# EAGLE design STM32-RF (EAGLE 6.4)
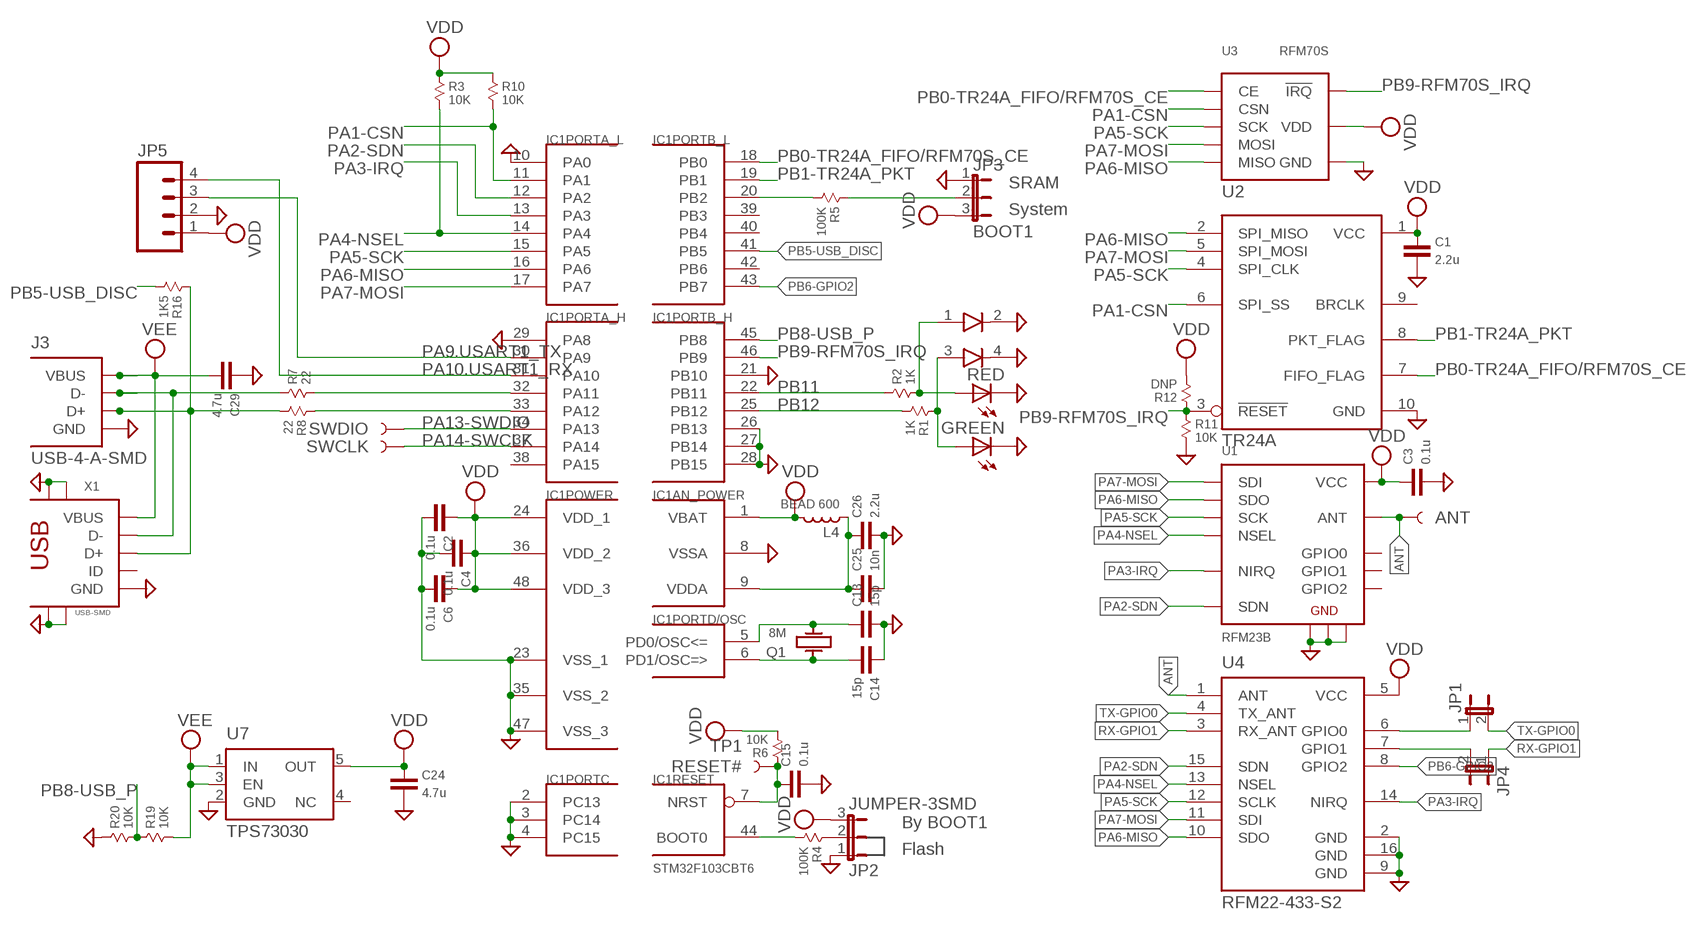
[diagram p0: schematic, sheet 1]

## Parts
ANT  TEST-POINT1  [PAD.1X1]
C1  2.2u  CAP-0603  [0603]
C2  0.1u  CAP-0603  [0603]
C3  0.1u  CAP-0603  [0603]
C4  0.1u  CAP-0603  [0603]
C6  0.1u  CAP-0603  [0603]
C13  15p  CAP-0603  [0603]
C14  15p  CAP-0603  [0603]
C15  0.1u  CAP-0603  [0603]
C24  4.7u  CAP-0603  [0603]
C25  10n  CAP-0603  [0603]
C26  2.2u  CAP-0603  [0603]
C29  4.7u  CAP-0603  [0603]
GREEN  LEDCHIPLED_0603  [CHIPLED_0603]
IC1  STM32F103CBT6  STM32F10XCXT6  [TQFP48]
J3  USB-4-A-SMD  [USB-A-SMD]
JP1  JUMPER-2SMD-NO  [SJ_2S-NO]
JP2  JUMPER-3SMD  [SJ_3]
JP3  BOOT1  JUMPER-3SMD  [SJ_3]
JP4  JUMPER-2SMD-NO  [SJ_2S-NO]
JP5  M04PTH  [1X04]
L4  BEAD 600  INDUCTOR-0603  [0603]
Q1  8M  CRYSTAL-KX-9A  [KX-9A]
R1  1K  RESISTOR-0603  [0603]
R2  1K  RESISTOR-0603  [0603]
R3  10K  RESISTOR-0603  [0603]
R4  100K  RESISTOR-0603  [0603]
R5  100K  RESISTOR-0603  [0603]
R6  10K  RESISTOR-0603  [0603]
R7  22  RESISTOR-0603  [0603]
R8  22  RESISTOR-0603  [0603]
R10  10K  RESISTOR-0603  [0603]
R11  10K  RESISTOR-0603  [0603]
R12  DNP  RESISTOR-0603  [0603]
R16  1K5  RESISTOR-0603  [0603]
R19  10K  RESISTOR-0603  [0603]
R20  10K  RESISTOR-0603  [0603]
RED  LEDCHIPLED_0603  [CHIPLED_0603]
RESET#  TP1  TEST-POINT1  [PAD.1X1]
SWCLK  TEST-POINT1  [PAD.1X1]
SWDIO  TEST-POINT1  [PAD.1X1]
U1  RFM23B  [RFM2X]
U2  TR24A  [TR24A]
U3  RFM70S  [RFM70S]
U4  RFM22-433-S2  [RFM2X]
U7  TPS73030  TPS73033  [SOT23-5]
U$1  LED-DUAL-0605  [LED-DUAL-0605]
X1  USB-SMD  [USB-MINIB]

## Nets
ANT: ANT.P$1 U1.1(ANT) U4.1(ANT)
BOOT0: IC1.44(RESET:BOOT0) R4.2
GND: C1.1 C2.1 C3.1 C4.1 C6.1 C13.1 C14.2 C15.1 C24.1 C25.1 C26.1 C29.2 GREEN.C IC1.2(PORTC:PC13) IC1.3(PORTC:PC14) IC1.4(PORTC:PC15) IC1.8(AN_POWER:VSSA) IC1.10(PORTA_L:PA0) IC1.21(PORTB_H:PB10) IC1.23(POWER:VSS_1) IC1.26(PORTB_H:PB13) IC1.27(PORTB_H:PB14) IC1.28(PORTB_H:PB15) IC1.29(PORTA_H:PA8) IC1.35(POWER:VSS_2) IC1.47(POWER:VSS_3) J3.GND JP2.1 JP3.1 JP5.2 R11.2 R20.1 RED.C U1.2(GND) U1.9(GND) U1.16(GND) U2.10(GND) U3.GND U4.2(GND) U4.9(GND) U4.16(GND) U7.2(GND) U$1.2 U$1.4 X1.GND X1.GND@1(GND) X1.GND@2(GND) X1.GND@3(GND) X1.GND@4(GND)
LED-RED: R2.2 RED.A U$1.1
N$3: C25.2 C26.2 IC1.9(AN_POWER:VDDA) L4.1
N$4: JP1.1 U4.6(GPIO0)
N$5: GREEN.A R1.1 U$1.3
N$6: JP4.2 U4.7(GPIO1)
N$7: JP2.2 R4.1
N$8: JP3.2 R5.1
N$10: J3.D- R7.1 X1.D-
N$13: J3.D+ R8.2 R16.1 X1.D+
OSCIN: C14.1 IC1.6(PORTD/OSC:PD1/OSC=>) Q1.1
OSCOUT: C13.2 IC1.5(PORTD/OSC:PD0/OSC<=) Q1.3
PA1-CSN: IC1.11(PORTA_L:PA1) R10.2 U2.6(SPI_SS) U3.CSN
PA2-SDN: IC1.12(PORTA_L:PA2) U1.15(SDN) U4.15(SDN)
PA3-IRQ: IC1.13(PORTA_L:PA3) U1.14(NIRQ) U4.14(NIRQ)
PA4-NSEL: IC1.14(PORTA_L:PA4) R3.2 U1.13(NSEL) U4.13(NSEL)
PA5-SCK: IC1.15(PORTA_L:PA5) U1.12(SCK) U2.4(SPI_CLK) U3.SCK U4.12(SCLK)
PA6-MISO: IC1.16(PORTA_L:PA6) U1.10(SDO) U2.2(SPI_MISO) U3.MISO U4.10(SDO)
PA7-MOSI: IC1.17(PORTA_L:PA7) U1.11(SDI) U2.5(SPI_MOSI) U3.MOSI U4.11(SDI)
PA9.USART1_TX: IC1.30(PORTA_H:PA9) JP5.3
PA10.USART1_RX: IC1.31(PORTA_H:PA10) JP5.4
PA11: IC1.32(PORTA_H:PA11) R7.2
PA12: IC1.33(PORTA_H:PA12) R8.1
PA13-SWDIO: IC1.34(PORTA_H:PA13) SWDIO.P$1
PA14-SWCLK: IC1.37(PORTA_H:PA14) SWCLK.P$1
PB0-TR24A_FIFO/RFM70S_CE: IC1.18(PORTB_L:PB0) U2.7(FIFO_FLAG) U3.CE
PB1-TR24A_PKT: IC1.19(PORTB_L:PB1) U2.8(PKT_FLAG)
PB2/BOOT1: IC1.20(PORTB_L:PB2) R5.2
PB5-USB_DISC: IC1.41(PORTB_L:PB5) R16.2
PB6-GPIO2: IC1.43(PORTB_L:PB7) U4.8(GPIO2)
PB8-USB_P: IC1.45(PORTB_H:PB8) R19.1 R20.2
PB9-RFM70S_IRQ: IC1.46(PORTB_H:PB9) R11.1 R12.1 U2.3(!RESET) U3.IRQ(!IRQ)
PB11: IC1.22(PORTB_H:PB11) R2.1
PB12: IC1.25(PORTB_H:PB12) R1.2
RESET#: C15.2 IC1.7(RESET:NRST) R6.1 RESET#.P$1
RX-GPIO1: JP4.1 U4.3(RX_ANT)
TX-GPIO0: JP1.2 U4.4(TX_ANT)
VDD: C1.2 C2.2 C3.2 C4.2 C6.2 C24.2 IC1.1(AN_POWER:VBAT) IC1.24(POWER:VDD_1) IC1.36(POWER:VDD_2) IC1.48(POWER:VDD_3) JP2.3 JP3.3 JP5.1 L4.2 R3.1 R6.2 R10.1 R12.2 U1.5(VCC) U2.1(VCC) U3.VDD U4.5(VCC) U7.5(OUT)
VEE: C29.1 J3.VUSB(VBUS) R19.2 U7.1(IN) U7.3(EN) X1.VBUS
Unconnected: IC1.38(PORTA_H:PA15) IC1.39(PORTB_L:PB3) IC1.40(PORTB_L:PB4) IC1.42(PORTB_L:PB6) U1.3(NC) U1.4(NC) U1.6(GPIO0) U1.7(GPIO1) U1.8(GPIO2) U2.9(BRCLK) U7.4(NC) X1.ID

## Notes on the sheet
- SRAM
- System
- By BOOT1
- Flash

## Library data of the parts
ANT RESET# SWCLK SWDIO = SparkFun:TEST-POINT
C1-C4 C6 C13-C15 C24-C26 C29 = X893:CAP: Capacitor
GREEN RED = led:LED: LED OSRAM: - CHIPLED LG R971, LG N971, LY N971, LG Q971, LY Q971, LO R971, LY R971 LH N974, LH R974 LS Q976, LO Q976, LY Q976 LO Q996 - Hyper CHIPLED LW Q18S LB Q993, LB Q99A, LB R99A - SideLED LS A670, LO A670, LY A670, LG A670, LP A670 LB A673, LV A673, LT A673, LW A673 LH A674 LY A675 LS A676, LA A676, LO A676, LY A676, LW A676 LS A679, LY A679, LG A679 - Hyper Micro SIDELED® LS Y876, LA Y876, LO Y876, LY Y876 LT Y87S - SmartLED LW L88C, LW L88S LB L89C, LB L89S, LG L890 LS L89K, LO L89K, LY L89K LS L896, LA L896, LO L896, LY L896 - TOPLED LS T670, LO T670, LY T670, LG T670, LP T670 LSG T670, LSP T670, LSY T670, LOP T670, LYG T670 LG T671, LOG T671, LSG T671 LB T673, LV T673, LT T673, LW T673 LH T674 LS T676, LA T676, LO T676, LY T676, LB T676, LH T676, LSB T676, LW T676 LB T67C, LV T67C, LT T67C, LS T67K, LO T67K, LY T67K, LW E67C LS E67B, LA E67B, LO E67B, LY E67B, LB E67C, LV E67C, LT E67C LW T67C LS T679, LY T679, LG T679 LS T770, LO T770, LY T770, LG T770, LP T770 LB T773, LV T773, LT T773, LW T773 LH T774 LS E675, LA E675, LY E675, LS T675 LS T776, LA T776, LO T776, LY T776, LB T776 LHGB T686 LT T68C, LB T68C - Hyper Mini TOPLED® LB M676 - Mini TOPLED Santana® LG M470 LS M47K, LO M47K, LY M47K Source: http://www.osram.convergy.de LUXEON: - LUMILED® LXK2-PW12-R00, LXK2-PW12-S00, LXK2-PW14-U00, LXK2-PW14-V00 LXK2-PM12-R00, LXK2-PM12-S00, LXK2-PM14-U00 LXK2-PE12-Q00, LXK2-PE12-R00, LXK2-PE12-S00, LXK2-PE14-T00, LXK2-PE14-U00 LXK2-PB12-K00, LXK2-PB12-L00, LXK2-PB12-M00, LXK2-PB14-N00, LXK2-PB14-P00, LXK2-PB14-Q00 LXK2-PR12-L00, LXK2-PR12-M00, LXK2-PR14-Q00, LXK2-PR14-R00 LXK2-PD12-Q00, LXK2-PD12-R00, LXK2-PD12-S00 LXK2-PH12-R00, LXK2-PH12-S00 LXK2-PL12-P00, LXK2-PL12-Q00, LXK2-PL12-R00 Source: www.luxeon.com KINGBRIGHT: KA-3528ASYC Source: www.kingbright.com
IC1 = stm32:STM32F10XCXT6: ST STM32F101/103 48pin LQFP
J3 = X893:USB-4: http://www.hirose.co.jp/cataloge_hp/e24200011.pdf
JP1 JP4 = SparkFun:JUMPER-2: Jumper Basic 0.1" spaced jumper. Use with breakaway headers.
JP2 JP3 = SparkFun:JUMPER-3
JP5 = SparkFun:M04: Header 4 Standard 4-pin 0.1" header. Use with straight break away headers (SKU : PRT-00116), right angle break away headers (PRT-00553), swiss pins (PRT-00743), machine pins (PRT-00117), and female headers (PRT-00115). Molex polarized connector foot print use with SKU : PRT-08231 with associated crimp pins and housings.
L4 = X893:INDUCTOR: http://www.murata.com/products/catalog/pdf/o05e.pdf
Q1 = X893:CRYSTAL: Crystal
R1-R8 R10-R12 R16 R19 R20 = X893:RESISTOR
U1 = X893:RFM23B
U2 = X893:TR24A
U3 = X893:RFM70S: http://www.terraelectronica.ru/pdf/HOPERF/RFM70.pdf
U4 = X893:RFM22: http://www.terraelectronica.ru/pdf/HOPERF/RFM22.pdf
U7 = X893:TPS73033: LOW-NOISE, HIGH PSRR, RF 200-mA LOW-DROPOUT LINEAR REGULATOR http://www.terraelectronica.ru/pdf/TI/TPS73033.pdf
U$1 = X893:LED-DUAL
X1 = X893:USB: USB Connectors USB-B-PTH is fully proven SKU : PRT-00139 USB-miniB is fully proven SKU : PRT-00587 USB-A-PCB is untested. USB-A-H is throughly reviewed, but untested. Spark Fun Electronics SKU : PRT-00437 USB-B-SMT is throughly reviewed, but untested. Needs silkscreen touching up. USB-A-S has not been used/tested USB-MB-H has not been used/tested

## Board
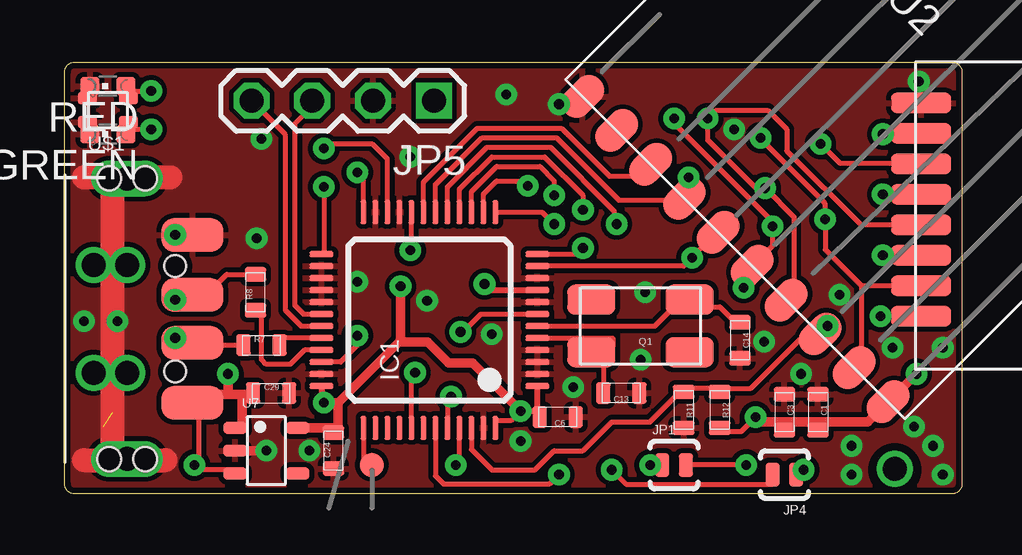
[diagram p1: board, top side]
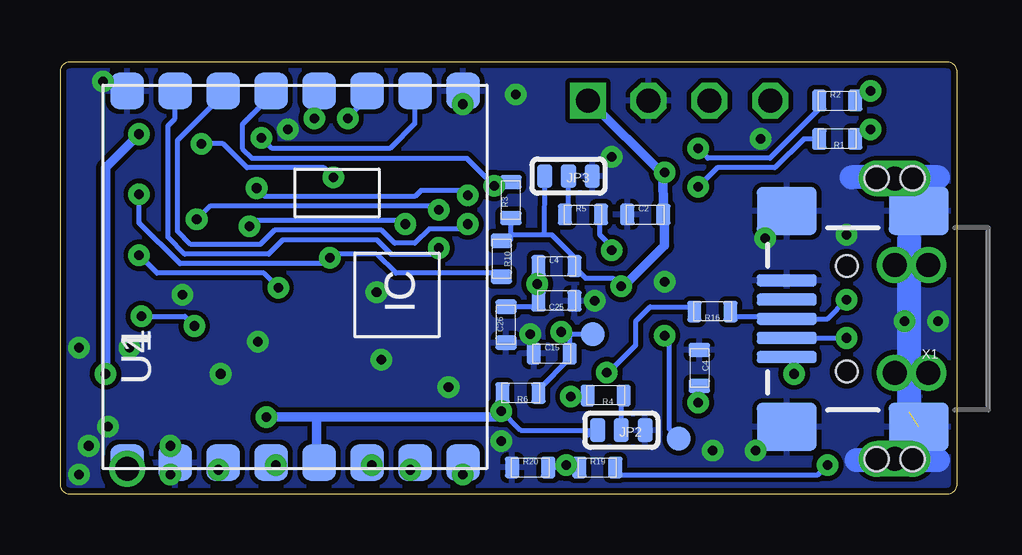
[diagram p2: board, bottom side, seen from below]

Size 37.4 x 18 mm. Coordinates in mm from the lower left corner, seen from the top.
Outline: 0,0.4 0,17.6 arc-90 0.4,18 37,18 arc-90 37.4,17.6 37.4,0.4 arc-90 37,0 0.4,0 arc-90 0,0.4
Copper layers (1+16): Top 0.035mm / dielectric 1.5mm / Bottom 0.035mm
Design rules "Rezonit": minimum track width 0.2mm, minimum drill 0.4mm, track to track 0.2mm, track to pad 0.2mm, pad to pad 0.2mm, via to via 0.2mm, smd to smd 0mil, copper to edge 0.25mm, drill to drill 0.2mm, minimum pad ring 0.25mm, minimum via ring 0.25mm, stop-mask expansion 4mil, vias tented up to drill 0.4mm, thermal gap 0.2mm
tRestrict: area 33.6,0 to 35.6,2
bRestrict: area 33.6,0 to 35.6,2

### Footprints (pad centres in the part's own frame; a part is rotated, then mirrored left to right if it is on the bottom)
PAD.1X1 = smd 1 x 1: P$1 0,0
0603 = smd 0.6 x 0.9: 1 -0.75,0; 2 0.75,0
CHIPLED_0603 = smd 0.8 x 0.8: A 0,-0.75; C 0,0.75
TQFP48 = smd 0.25 x 1: 1 -2.75,-4.5; 2 -2.25,-4.5; 3 -1.75,-4.5; 4 -1.25,-4.5; 5 -0.75,-4.5; 6 -0.25,-4.5; 7 0.25,-4.5; 8 0.75,-4.5; 9 1.25,-4.5; 10 1.75,-4.5; 11 2.25,-4.5; 12 2.75,-4.5; 25 2.75,4.5; 26 2.25,4.5; 27 1.75,4.5; 28 1.25,4.5; 29 0.75,4.5; 30 0.25,4.5; 31 -0.25,4.5; 32 -0.75,4.5; 33 -1.25,4.5; 34 -1.75,4.5; 35 -2.25,4.5; 36 -2.75,4.5 | smd 1 x 0.25: 13 4.5,-2.75; 14 4.5,-2.25; 15 4.5,-1.75; 16 4.5,-1.25; 17 4.5,-0.75; 18 4.5,-0.25; 19 4.5,0.25; 20 4.5,0.75; 21 4.5,1.25; 22 4.5,1.75; 23 4.5,2.25; 24 4.5,2.75; 37 -4.5,2.75; 38 -4.5,2.25; 39 -4.5,1.75; 40 -4.5,1.25; 41 -4.5,0.75; 42 -4.5,0.25; 43 -4.5,-0.25; 44 -4.5,-0.75; 45 -4.5,-1.25; 46 -4.5,-1.75; 47 -4.5,-2.25; 48 -4.5,-2.75
USB-A-SMD = smd 2.6 x 1.4: D+ 5.325,1; D- 5.325,-1; GND 5.325,3.5; VUSB 5.325,-3.5 | drill 1 pad 1.4 long: GND@1 2.6,5.85; GND@2 2.6,-5.85 | drill 1: P$1 2.6,2.25; P$2 2.6,-2.25; P$3 1.2,2.25; P$4 1.2,-2.25 | hole 1: 3.35,-5.85; 1.85,-5.85; 3.35,5.85; 1.85,5.85
SJ_2S-NO = smd 0.6 x 1: 1 -0.49,0; 2 0.49,0
SJ_3 = smd 0.635 x 1: 1 -0.99,0; 2 0,0; 3 0.99,0
1X04 = drill 1 pad 1.5 square: 1 0,0 | drill 1 pad 1.5 octagon: 2 2.54,0; 3 5.08,0; 4 7.62,0
KX-9A = smd 2 x 1.25: 1 -2.05,-1.1; 2 2.05,-1.1; 3 2.05,1.1; 4 -2.05,1.1
RFM2X = smd 1.5 x 1.4: 1 -7.75,7; 2 -7.75,5; 3 -7.75,3; 4 -7.75,1; 5 -7.75,-1; 6 -7.75,-3; 7 -7.75,-5; 8 -7.75,-7; 9 7.75,-7; 10 7.75,-5; 11 7.75,-3; 12 7.75,-1; 13 7.75,1; 14 7.75,3; 15 7.75,5; 16 7.75,7
TR24A = smd 1.27 x 2: 1 9,-10.25; 2 7,-10.25; 3 5,-10.25; 4 3,-10.25; 5 1,-10.25; 6 -1,-10.25; 7 -3,-10.25; 8 -5,-10.25; 9 -7,-10.25; 10 -9,-10.25
RFM70S = smd 0.85 x 2.5: CE -2.16,-1.4; CSN -0.89,-1.4; GND -4.7,-1.4; IRQ 4.19,-1.4; MISO 2.92,-1.4; MOSI 1.65,-1.4; SCK 0.38,-1.4; VDD -3.43,-1.4
SOT23-5 = smd 0.5 x 1: 1 -0.95,-1.3; 2 0,-1.3; 3 0.95,-1.3; 4 0.95,1.3; 5 -0.95,1.3
LED-DUAL-0605 = smd 0.5 x 0.8: 1 -0.5,0.85; 2 -0.5,-0.85; 3 0.5,0.85; 4 0.5,-0.85
USB-MINIB = smd 2.5 x 0.5: D+ 2.5,0; D- 2.5,0.8; GND 2.5,-1.6; ID 2.5,-0.8; VBUS 2.5,1.6 | smd 2.5 x 2: GND@1 -3,-4.5; GND@2 -3,4.5; GND@3 2.5,4.5; GND@4 2.5,-4.5 | hole 0.9: 0,2.2; 0,-2.2

### Placement (x,y rotation side)
ANT  34.6,1.05 0 top
C1  31.4,3.4 270 top
C2  13,11.65 0 bottom
C3  30,3.4 270 top
C4  10.75,5.25 270 bottom
C6  20.55,3.2 180 top
C13  23.2,4.2 180 top
C14  28.15,6.4 270 top
C15  16.9,5.85 0 bottom
C24  11.2,1.8 90 top
C25  16.7,8.05 180 bottom
C26  18.8,7.05 90 bottom
C29  8.6,4.2 0 top
GREEN  1.8,15 90 top
IC1  15.2,7.25 90 top
J3  0,7.3 0 top
JP1  25.4,1.2 0 top
JP2  14,2.65 180 bottom
JP3  16.2,13.25 180 bottom
JP4  30,0.8 180 top
JP5  15.4,16.39 180 top
L4  16.7,9.5 0 bottom
Q1  24,7 180 top
R1  5,14.8 180 bottom
R2  5,16.4 0 bottom
R3  18.6,12.25 90 bottom
R4  14.65,4.1 180 bottom
R5  15.6,11.65 0 bottom
R6  18.2,4.2 180 bottom
R7  8.2,6.2 0 top
R8  7.95,8.4 90 top
R10  19,9.8 270 bottom
R11  25.8,3.5 270 top
R12  27.3,3.5 270 top
R16  10.2,7.6 180 bottom
R19  15,1.1 0 bottom
R20  17.8,1.1 0 bottom
RED  1.8,17 90 top
RESET#  15.2,6.65 270 bottom
SWCLK  12.8,1.2 0 top
SWDIO  11.6,2.3 0 bottom
U1  27.6,9.05 90 bottom
U2  35.2,17.45 315 top
U3  37.1,11.6 270 top
U4  27.6,9.05 90 bottom
U7  8.4,1.8 270 top
U$1  1.8,16 270 top
X1  4.6,7.3 180 bottom

### Tracks (layer width: path | path; a pad name or v marks a point on that pad's centre or on a via)
ANT  (via drill 1)
  Bottom 0.2: ANT.P$1 U4.1
  other vias: 34.6,1.05
BOOT0  (via drill 0.4)
  Top 0.2: IC1.44 15.95,3.9 v16.1,4.05
  Bottom 0.2: R4.2 16,4.1 v16.1,4.05
GND  (via drill 0.4)  (1 unrouted)
  Top 0.2: RED.C 0.95,16.9 U$1.2
  Top 0.4: 7,1.8 v8.4,1.8
  Top 1: 0.8,1.4 2,1.4 | 2,1.4 4.2,1.4 | 0.8,13.2 2,13.2 | 2,13.2 4.4,13.2 | 2,1.4 2,13.2
  Bottom 1: 0.8,1.4 4.2,1.4 | 0.8,13.2 4.4,13.2 | 2,3.4 2,10.6
  other vias: 8,10.65 17.8,6.65 19,2.2 21.2,4.45 24.2,8.4 29.15,6.35 34.5,6.1 18.4,16.65 4.6,10.8 8.2,14.8 27.9,15.2 30.7,5 35.6,17.2 15.1,8.05 14.4,14.05 20.6,16.25 2.2,7.2 0.8,7.2 12.2,8.85 24,5.6 10.2,1.8 32.3,8.3 36.2,2 36.6,0.8 32.8,2 36.6,6.1 35.4,2.8 32.8,0.8
  pour Top: 0.2,17.8 0.2,0.2 37.2,0.2 37.2,17.8
  pour Bottom: 0.2,17.8 0.2,0.2 37.2,0.2 37.2,17.8
LED-RED  (via drill 0.4)
  Top 0.2: RED.A 2.65,16.9 | 2.65,16.9 U$1.1 | 2.65,16.9 2.75,16.8 v3.6,16.8
  Bottom 0.2: R2.2 4.2,16.6 3.8,16.6 v3.6,16.8
N$3  (via drill 0.4)
  Top 0.2: 19.45,8.5 IC1.9
  Top 0.25: 19.45,8.5 17.75,8.5 v17.5,8.75
  Bottom 0.2: 17.52,8.12 17.52,8.72 v17.5,8.75 17.45,8.82 L4.1 | C26.2 17.5,7.8 C25.2
  Bottom 0.3: C25.2 17.52,8.12
N$4  (via drill 0.4)
  Top 0.2: JP1.1 v24.4,1.2
  Bottom 0.2: v24.4,1.2 24.5,1.4 U4.6
N$5  (via drill 0.4)
  Top 0.2: GREEN.A 2.65,15.1 | 2.65,15.1 U$1.3 | 2.65,15.1 2.6,15.15 2.6,15.2 v3.6,15.2
  Bottom 0.2: R1.1 4.2,15 3.8,15 v3.6,15.2
N$6  (via drill 0.4)
  Top 0.2: v22.8,1 23.4,0.4 29.51,0.4 JP4.2
  Bottom 0.2: U4.7 22.7,1.1 v22.8,1
N$7
  Bottom 0.2: JP2.2 14,4 R4.1
N$8
  Bottom 0.2: R5.1 16.2,11.78 JP3.2
N$10  (via drill 0.4)
  Top 0.2: R7.1 5.8,6.2 5.8,6.25 J3.D- 5.17,6.4 v4.6,6.5
  Bottom 0.2: X1.D- v4.6,6.5
N$13  (via drill 0.4)
  Top 0.2: R8.2 6.75,9.15 5.85,8.25 J3.D+ 5.28,8.2 v4.6,8.1
  Bottom 0.2: v4.6,8.1 5.4,7.3 X1.D+ 7,7.4 9.4,7.4 9.45,7.45 R16.1
OSCIN
  Top 0.2: C14.1 28.12,7.12 28.05,7.2 27.9,7.2 27.3,7.8 26.1,7.8 Q1.1 25.5,7.9 24.6,7 IC1.6
OSCOUT
  Top 0.2: IC1.5 22.85,6.5 22.85,6.15 22.7,6 21.85,6.2 21.9,6.2 Q1.3 22.25,5.85 22.45,5.85 22.45,4.15 22.48,4.08 C13.2
PA1-CSN  (via drill 0.4)
  Top 0.2: IC1.11 25.8,9.5 v26.15,9.85 26.1,9.85 26.8,10.55 26.89,10.55 U2.6 | v34.1,12.49 U3.CSN
  Bottom 0.2: v34.1,12.49 34.1,11.3 32.4,9.6 26.4,9.6 v26.15,9.85 26,10 24.2,10 23.4,9.2 18.8,9.2 R10.2
PA2-SDN  (via drill 0.4)
  Top 0.2: IC1.12 21.45,10 v21.6,10.25
  Bottom 0.2: U4.15 32.6,15.65 32.9,15.35 32.9,10.7 32.2,10 28.7,10 28.1,10.6 24.2,10.6 23.6,10 21.85,10 v21.6,10.25
PA3-IRQ  (via drill 0.4)
  Top 0.2: IC1.13 19.9,11.75 v20.4,11.25
  Bottom 0.2: v20.4,11.25 20.6,11.05 22,11.05 22.6,10.45 23.45,10.45 24,11 28.45,11 29.05,10.4 31.95,10.4 32.5,10.95 32.5,14.75 30.6,16.65 U4.14
PA4-NSEL  (via drill 0.4)
  Top 0.2: IC1.14 17.45,12.5 18,13.05 19.1,13.05 v19.3,12.85
  Bottom 0.2: R3.2 19.12,12.97 v19.3,12.85 20.45,14 29.4,14 29.8,14.4 29.8,15.4 28.8,16.4 28.8,16.6 U4.13
PA5-SCK  (via drill 0.4)
  Top 0.2: IC1.15 16.95,12.6 18,13.65 19.8,13.65 20.4,13.05 v20.4,12.45 | U2.4 30.4,8.41 30.4,11.55 v29.2,12.75 28.8,12.75 26.8,14.75 v26.8,15.65 27.15,16 29.3,16 30.1,15.2 30.1,14.3 33.18,11.22 U3.SCK
  Bottom 0.2: v20.4,12.45 20.6,12.65 22.35,12.65 22.6,12.4 28.85,12.4 v29.2,12.75 | 26.6,16.85 U4.12 v26.8,15.65
PA6-MISO  (via drill 0.4)
  Top 0.2: IC1.16 16.45,12.7 17.8,14.05 20,14.05 21.6,12.45 v21.6,11.85 | U2.2 33.2,6.15 33.2,8.68 | 33.2,8.68 U3.MISO | v29,14.85 29.1,14.75 29.1,14.7 31.7,12.1 v31.7,11.45 31.7,10.18 33.2,8.68
  Bottom 0.2: U4.10 22.6,15.45 23.65,14.4 28.55,14.4 v29,14.85 | v21.6,11.85 21.65,11.85 21.8,12 31.15,12 v31.7,11.45
PA7-MOSI  (via drill 0.4)
  Top 0.2: IC1.17 15.95,12.8 17.6,14.45 20.25,14.45 22.9,11.8 22.9,11.35 v23,11.25 | v25.4,15.65 25.4,15.45 29.5,11.35 v29.5,11.15 29.5,10.34 U2.5 28.66,8.96 v28.3,8.6 | v34.1,9.95 U3.MOSI
  Bottom 0.2: U4.11 24.8,16.45 24.8,16.3 25.3,15.8 25.35,15.6 v25.4,15.65 | v28.3,8.6 28.9,9.2 33.35,9.2 v34.1,9.95 | v23,11.25 23.05,11.25 23.2,11.4 29.25,11.4 v29.5,11.15
PA9.USART1_TX
  Top 0.2: IC1.30 9.95,7.5 9.6,7.85 9.6,15.45 10.2,16.05 10.2,16.27 JP5.3
PA10.USART1_RX
  Top 0.2: IC1.31 9.85,7 9.2,7.65 9.2,14.97 JP5.4
PA11
  Top 0.2: IC1.32 9.1,6.5 9.1,6.2 R7.2
PA12
  Top 0.2: IC1.33 10,6 9.4,5.4 8.4,5.4 8.2,5.6 8.2,7.4 R8.1
PA13-SWDIO  (via drill 0.4)
  Top 0.2: v12.2,6.6 12.2,6.2 11.5,5.5 IC1.34
  Bottom 0.2: SWDIO.P$1 12,2.7 12,6.4 v12.2,6.6
PA14-SWCLK
  Top 0.2: IC1.37 12.45,1.25 SWCLK.P$1
PB0-TR24A_FIFO/RFM70S_CE  (via drill 0.4)
  Top 0.2: IC1.18 15.45,12.9 17.4,14.85 20.5,14.85 23.1,12.25 25.36,12.25 U2.7 25.92,12.32 v26,13.2 | v31.5,14.6 32.3,13.8 35.51,13.8 U3.CE
  Bottom 0.2: v26,13.2 26.4,13.6 29.6,13.6 30.6,14.6 v31.5,14.6
PB1-TR24A_PKT
  Top 0.2: IC1.19 14.95,13 17.2,15.25 20.7,15.25 22.7,13.25 23.93,13.25 U2.8
PB2/BOOT1  (via drill 0.4)
  Top 0.2: IC1.20 14.45,10.2 v14.4,10.15
  Bottom 0.2: R5.2 14.9,11.45 14.9,10.8 14.4,10.3 14.45,10.2 v14.4,10.15
PB5-USB_DISC  (via drill 0.4)
  Top 0.2: IC1.41 14.45,5.05 v14.6,5.05
  Bottom 0.2: v14.6,5.05 14.4,5.2 13.4,6.2 13.4,7.2 12.8,7.8 11.15,7.8 R16.2
PB6-GPIO2  (via drill 0.4)
  Top 0.2: v20.6,0.8 20.2,0.4 15.8,0.4 15.45,0.75 IC1.43
  Bottom 0.2: U4.8 v20.6,0.8
PB8-USB_P  (via drill 0.4)
  Top 0.2: IC1.45 16.45,1.3 v16.3,1.2
  Bottom 0.2: R20.2 16.3,1.1 | R19.1 16.3,1.1 | 16.3,1.1 v16.3,1.2
PB9-RFM70S_IRQ  (via drill 0.4)
  Top 0.2: U2.3 31.57,6.67 | U2.3 31.2,6.38 30.6,6.4 28.6,4.4 27.4,4.4 27.4,4.35 R12.1 27.3,4.3 27.2,4.4 25.95,4.4 R11.1 25.75,4.2 25.6,4.2 24.4,3 22.8,3 21.6,1.8 20.4,1.8 19.6,1 17.8,1 16.95,1.85 IC1.46 | U3.IRQ v34.01,7.41 v34,7.4 | v31.8,7 31.8,6.98 U2.3
  Bottom 0.2: v34,7.4 32.2,7.4 v31.8,7
PB11  (via drill 0.4)
  Top 0.2: v10.8,14.4 11,14.6 12.8,14.6 13.45,13.95 IC1.22
  Bottom 0.2: R2.1 5.8,16.35 5.8,16 7.8,14 10.4,14 v10.8,14.4
PB12  (via drill 0.4)
  Top 0.2: v10.8,12.8 10.8,10.1 IC1.25
  Bottom 0.2: R1.2 6.4,14.8 7.6,13.6 10,13.6 v10.8,12.8
RESET#  (via drill 0.4)
  Top 0.2: IC1.7 17.35,7.5 16.6,6.75 v16.5,6.75
  Bottom 0.2: R6.1 17.4,4.4 16.2,5.6 16.2,5.8 C15.2 16.15,6.6 16.5,6.6 v16.5,6.75 16.4,6.65 RESET#.P$1
RX-GPIO1  (via drill 0.4)
  Top 0.2: JP4.1 v30.8,1
  Bottom 0.2: v30.8,1 30.7,1.4 U4.3
TX-GPIO0  (via drill 0.4)
  Top 0.2: v28.4,1.2 JP1.2
  Bottom 0.2: U4.4 28.5,1.3 v28.4,1.2
VDD  (via drill 0.4)
  Top 0.2: IC1.36 11,4.5 | IC1.48 17.95,3 18,3.05 18.6,3.05 v19,3.45 | IC1.24 12.45,13.15 v12.2,13.4 | 27.6,2.55 R12.2 27.3,2.7 27.4,2.6 28.2,2.6 v28.8,3.2
  Top 0.25: v19,3.45 19.88,3.45 C6.2 19.7,3.67 IC1.1 | U7.5 9.6,2.65 | 11.3,2.75 C24.2 | IC1.36 10.7,3.8 v10.8,3.8
  Top 0.4: U7.5 11.3,2.75 | v19,3.45 17,5.45 16,5.45 15.12,6.33 14,6.33 | v35.5,5 34.34,3.84 U2.1 33.48,3 31.4,3 | v34.1,15 34.13,15.03 U3.VDD | C24.2 11.4,2.6 11.4,3.8 | 11.4,3.8 v10.8,3.8 | 11.4,3.8 13.93,6.33 14,6.33 | v14,8.65 14,6.33 | 31.4,3 30,3 | 30,3 29,3 v28.8,3.2 | C1.2 31.4,3 | C3.2 30,3
  Bottom 0.2: 15.4,2.45 15.39,2.44 JP2.3 18.2,2.65 v19,3.45 18.95,3.5 R6.2 | 17.19,10.8 JP3.3 | 17.19,10.8 16.9,10.8 15.97,9.88 L4.2 15.95,9.45 15.5,9 14.35,9 v14,8.65 | 17.19,10.8 18.6,10.8 | R10.1 18.8,10.6 18.6,10.6 18.6,10.8 | 18.6,10.8 R3.1
  Bottom 0.4: C2.2 12.25,11.75 12.2,11.8 12.2,10.35 13.95,8.6 14.05,8.6 v14,8.65 | 12.25,11.62 C2.2 | JP5.1 15.26,16.25 15.2,16.25 12.4,13.45 v12.2,13.4 12.28,13.47 C2.2 | 26.7,3.21 v28.8,3.2 | U4.5 26.7,1.41 26.7,3.21 | v35.5,5 35.5,13.6 v34.1,15 | C4.2 10.75,3.85 v10.8,3.8 | 26.7,3.21 19.24,3.21 v19,3.45
VEE  (via drill 0.4)
  Top 0.2: 6.1,4.15 J3.VUSB 5.6,3.67 5.6,1 | U7.3 7.1,1 5.6,1 | 6.8,2.75 6.8,2.7 U7.1 | 5.6,1 v5.4,1.2
  Top 0.4: 6.1,4.15 6.8,4.15 | 7.4,4.15 7.8,4.15 C29.1 | v6.8,5 6.8,4.15 | 6.8,2.75 7.4,2.75 7.4,4.15 | 7.4,4.15 6.8,4.15
  Bottom 0.2: R19.2 14.2,0.8 5.8,0.8 v5.4,1.2
  Bottom 0.4: X1.VBUS 6.8,5.7 6.8,5.2 6.9,5.1 v6.8,5

### Text on the board
tDocu: PB1-D28 | PB0-D27 nRESET | PA1-D3 SWDIO-TMS | PA7-D11-MOSI TDI | PA6-MISO | PA7-MOSI | PA5-SCK | PA4-NSEL | PA3-IRQ | PA2-SDN | PA5-D13-SCK SWCLK-TCK | PB9-D24 | PA6-D12-MISO TDO | PA10-USART1_RX | PA9-USART1_TX | GND | +3.3V | GND | +3.3V | RED | GREEN | GND | VDD | PB0-D27 | nRESET | PA1-D3 | SWDIO-TMS | PA5-D13-SCK | SWCLK-TCK | PA7-D11-MOSI | TDI | PA6-D12-MISO | TDO | PB9-D24 | PA13-SWDIO | PA14-SWCLK